# EAGLE schematic FreeRTOS-ESP32-schematic (EAGLE 9.7.0)
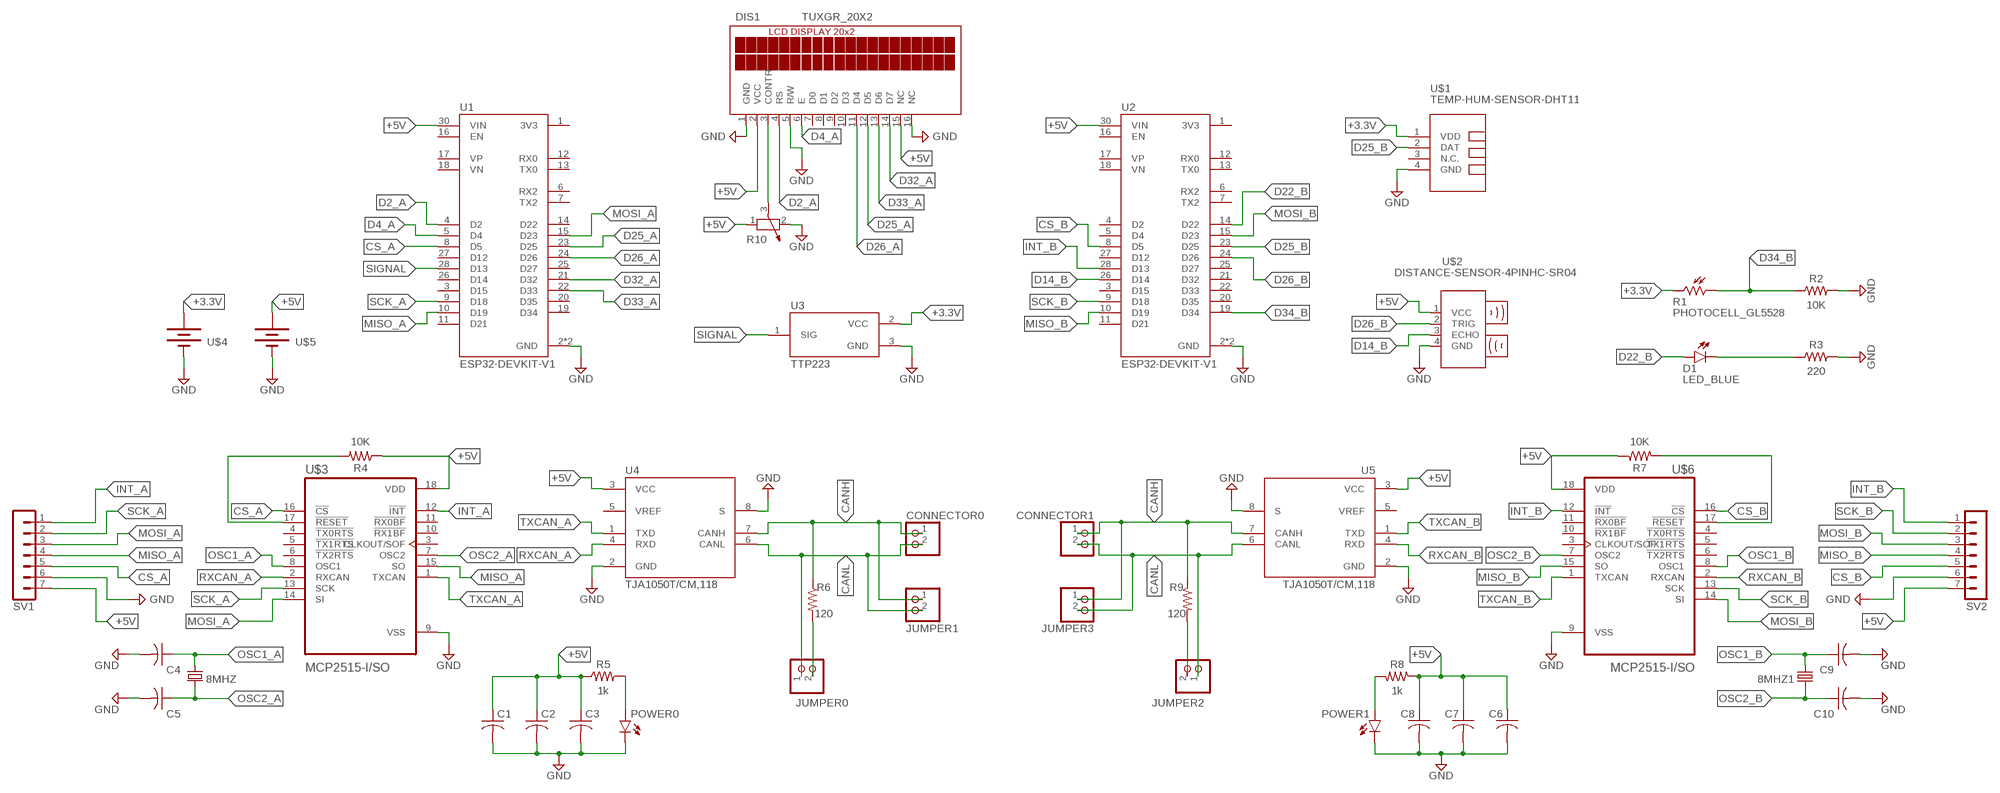
[diagram p0: schematic, sheet 1]

## Parts
8MHZ  CRYSTAL_HC49-11.5L  [XTALRR488W45L1150T500H350B]
8MHZ1  CRYSTAL_HC49-11.5L  [XTALRR488W45L1150T500H350B]
C1  C-USC0805  [C0805]
C2  C-USC0805  [C0805]
C3  C-USC0805  [C0805]
C4  C-USC0805  [C0805]
C5  C-USC0805  [C0805]
C6  C-USC0805  [C0805]
C7  C-USC0805  [C0805]
C8  C-USC0805  [C0805]
C9  C-USC0805  [C0805]
C10  C-USC0805  [C0805]
CONNECTOR0  PINHD-1X2/90  [1X02/90]
CONNECTOR1  PINHD-1X2/90  [1X02/90]
D1  LED_BLUE  LED_CHIPBLUE-3216  [LEDC3216X110N_B]
DIS1  TUXGR_20X2  [TUXGR_20X2]
JUMPER0  PINHD-1X2/90  [1X02/90]
JUMPER1  PINHD-1X2/90  [1X02/90]
JUMPER2  PINHD-1X2/90  [1X02/90]
JUMPER3  PINHD-1X2/90  [1X02/90]
POWER0  LED_BLUE  LED_CHIPBLUE-3216  [LEDC3216X110N_B]
POWER1  LED_BLUE  LED_CHIPBLUE-3216  [LEDC3216X110N_B]
R1  PHOTOCELL_GL5528  [GL5528]
R2  10K  R-US_CHIP-0805(2012-METRIC)  [RESC2012X65]
R3  220  R-US_CHIP-0805(2012-METRIC)  [RESC2012X65]
R4  10K  R-US_CHIP-0805(2012-METRIC)  [RESC2012X65]
R5  1k  R-US_CHIP-0805(2012-METRIC)  [RESC2012X65]
R6  120  R-US_CHIP-0805(2012-METRIC)  [RESC2012X65]
R7  10K  R-US_CHIP-0805(2012-METRIC)  [RESC2012X65]
R8  1k  R-US_CHIP-0805(2012-METRIC)  [RESC2012X65]
R9  120  R-US_CHIP-0805(2012-METRIC)  [RESC2012X65]
R10  POTENTIOMETER_PT-10  [PT-10]
SV1  MA07-1  [MA07-1]
SV2  MA07-1  [MA07-1]
U1  ESP32-DEVKIT-V1  [MODULE_ESP32_DEVKIT_V1]
U2  ESP32-DEVKIT-V1  [MODULE_ESP32_DEVKIT_V1]
U3  TTP223  [MODULE_ZC440600]
U4  TJA1050T/CM,118  [SOIC127P600X175-8N]
U5  TJA1050T/CM,118  [SOIC127P600X175-8N]
U$1  TEMP-HUM-SENSOR-DHT11  [TEMP-HUM-SENSOR-DHT11]
U$2  DISTANCE-SENSOR-4PINHC-SR04  [HC-SR04]
U$3  MCP2515-I/SO  [SOIC127P1030X265-18N]
U$4  BATTERYGENERIC  [BATTERY-GENERIC]
U$5  BATTERYGENERIC  [BATTERY-GENERIC]
U$6  MCP2515-I/SO  [SOIC127P1030X265-18N]

## Nets
+3.3V: R1.2 U3.2(VCC) U$1.1(VDD) U$4.+
+5V: C1.1 C2.1 C3.1 C6.1 C7.1 C8.1 DIS1.2(VCC) DIS1.15(NC) R4.1 R5.1 R7.1 R8.1 R10.1 SV1.7 SV2.7 U1.30(VIN) U2.30(VIN) U4.3(VCC) U5.3(VCC) U$2.1(VCC) U$3.18(VDD) U$5.+ U$6.18(VDD)
CANH: CONNECTOR0.1 CONNECTOR1.1 JUMPER1.1 JUMPER3.1 R6.1 R9.1 U4.7(CANH) U5.7(CANH)
CANL: CONNECTOR0.2 CONNECTOR1.2 JUMPER0.1 JUMPER1.2 JUMPER2.1 JUMPER3.2 U4.6(CANL) U5.6(CANL)
CS_A: SV1.5 U1.8(D5) U$3.16(!CS)
CS_B: SV2.5 U2.8(D5) U$6.16(!CS)
D2_A: DIS1.4(RS) U1.4(D2)
D4_A: DIS1.6(E) U1.5(D4)
D14_B: U2.26(D14) U$2.3(ECHO)
D22_B: D1.2(A) U2.14(D22)
D25_A: DIS1.12(D5) U1.23(D25)
D25_B: U2.23(D25) U$1.2(DAT)
D26_A: DIS1.11(D4) U1.24(D26)
D26_B: U2.24(D26) U$2.2(TRIG)
D32_A: DIS1.14(D7) U1.21(D32)
D33_A: DIS1.13(D6) U1.22(D33)
D34_B: R1.1 R2.1 U2.19(D34)
GND: C1.2 C2.2 C3.2 C4.2 C5.2 DIS1.1(GND) DIS1.5(R/W) DIS1.16(NC) POWER0.1(C) R2.2 R3.2 R10.2 SV1.6 U1.2(GND) U1.29(GND) U2.2(GND) U2.29(GND) U3.3(GND) U4.2(GND) U4.8(S) U$1.4(GND) U$2.4(GND) U$3.9(VSS) U$4.- U$5.-
GND1: C6.2 C7.2 C8.2 C9.2 C10.2 POWER1.1(C) SV2.6 U5.8(S) U$6.9(VSS) ; supply symbol labelled GND
INT_A: SV1.1 U$3.12(!INT)
INT_B: SV2.1 U2.28(D13) U$6.12(!INT)
MISO_A: SV1.4 U1.10(D19) U$3.15(SO)
MISO_B: SV2.4 U2.10(D19) U$6.15(SO)
MOSI_A: SV1.3 U1.15(D23) U$3.14(SI)
MOSI_B: SV2.3 U2.15(D23) U$6.14(SI)
N$1: R4.2 U$3.17(!RESET)
N$2: POWER0.2(A) R5.2
N$3: JUMPER0.2 R6.2
N$4: R7.2 U$6.17(!RESET)
N$5: POWER1.2(A) R8.2
N$6: JUMPER2.2 R9.2
N$7: U5.2(GND) ; supply symbol labelled GND
N$8: D1.1(C) R3.1
N$10: DIS1.3(CONTR) R10.3
OSC1_A: 8MHZ.1 C4.1 U$3.8(OSC1)
OSC1_B: 8MHZ1.1 C9.1 U$6.8(OSC1)
OSC2_A: 8MHZ.2 C5.1 U$3.7(OSC2)
OSC2_B: 8MHZ1.2 C10.1 U$6.7(OSC2)
RXCAN_A: U4.4(RXD) U$3.2(RXCAN)
RXCAN_B: U5.4(RXD) U$6.2(RXCAN)
SCK_A: SV1.2 U1.9(D18) U$3.13(SCK)
SCK_B: SV2.2 U2.9(D18) U$6.13(SCK)
SIGNAL: U1.28(D13) U3.1(SIG)
TXCAN_A: U4.1(TXD) U$3.1(TXCAN)
TXCAN_B: U5.1(TXD) U$6.1(TXCAN)
Unconnected: DIS1.7(D0) DIS1.8(D1) DIS1.9(D2) DIS1.10(D3) U1.1(3V3) U1.3(D15) U1.6(RX2) U1.7(TX2) U1.11(D21) U1.12(RX0) U1.13(TX0) U1.14(D22) U1.16(EN) U1.17(VP) U1.18(VN) U1.19(D34) U1.20(D35) U1.25(D27) U1.26(D14) U1.27(D12) U2.1(3V3) U2.3(D15) U2.4(D2) U2.5(D4) U2.6(RX2) U2.7(TX2) U2.11(D21) U2.12(RX0) U2.13(TX0) U2.16(EN) U2.17(VP) U2.18(VN) U2.20(D35) U2.21(D32) U2.22(D33) U2.25(D27) U2.27(D12) U4.5(VREF) U5.5(VREF) U$1.3(N.C.) U$3.3(CLKOUT/SOF) U$3.4(!TX0RTS) U$3.5(!TX1RTS) U$3.6(!TX2RTS) U$3.10(!RX1BF) U$3.11(!RX0BF) U$6.3(CLKOUT/SOF) U$6.4(!TX0RTS) U$6.5(!TX1RTS) U$6.6(!TX2RTS) U$6.10(!RX1BF) U$6.11(!RX0BF)

## Library data of the parts
8MHZ 8MHZ1 = Frequency-Source:CRYSTAL: Crystal 2Pin - Generic; CATEGORY: Frequency-Source; SERIES: HC49; SUB-CATEGORY: Crystal-2Pin
C1-C10 = rcl:C-US: CAPACITOR, American symbol; SPICEPREFIX: C
CONNECTOR0 CONNECTOR1 JUMPER0 JUMPER1-JUMPER3 = Connector:PINHD-1X2: PIN HEADER; CATEGORY: Headers; DESCRIPTION: Header, Right Angle, 2 Position; MANUFACTURER: Generic; MPN: Generic; OPERATING_TEMPERATURE: Generic; PART_STATUS: Active; PITCH: 0.100" (2.54mm); ROHS_COMPLIANCE: Generic; SERIES: Generic; SUB-CATEGORY: Headers, Male Pins; TYPE: Board to Board or Cable, Unshrouded, Through Hole, Right Angle
D1 POWER0 POWER1 = Opto-Electronic:LED_CHIP: LED - Generic; CATEGORY: Opto-Electronic; COLOR: Blue; SUB-CATEGORY: LED
DIS1 = display-lcd:TUXGR_20X2: Tuxgraphics LCD display 20x2 characters reflective, without background light Source: tuxgr_20x2.pdf; OC_FARNELL: unknown; OC_NEWARK: unknown
R1 = Tinkercad:PHOTOCELL: Photoresistor / Photoconductive cells Reference Datasheet <https://www.sunrom.com/get/753444>
R2-R9 = Resistor:R-US: Resistor Fixed - ANSI; CATEGORY: Resistor; SUB-CATEGORY: Fixed
R10 = rcl:POTENTIOMETER_: Potentiometer; SPICEMODEL: POT; SPICEPREFIX: X
SV1 SV2 = con-lstb:MA07-1: PIN HEADER; OC_FARNELL: unknown; OC_NEWARK: unknown
U1 U2 = ESP32-DEVKIT-V1:ESP32-DEVKIT-V1: Dual core, Wi-Fi: 2.4 GHz up to 150 Mbits/s,BLE (Bluetooth Low Energy) and legacy Bluetooth, 32 bits, Up to 240 MHz Check availability <https://pricing.snapeda.com/parts/ESP32-DEVKIT-V1/Do%20it/view-part?ref=eda>; AVAILABILITY: Not in stock; CHECK_PRICES: https://www.snapeda.com/parts/ESP32-DEVKIT-V1/Do+it/view-part/?ref=eda; DESCRIPTION: Dual core, Wi-Fi: 2.4 GHz up to 150 Mbits/s,BLE (Bluetooth Low Energy) and legacy Bluetooth, 32 bits, Up to 240 MHz; MF: Do it; MP: ESP32-DEVKIT-V1; PACKAGE: None; PRICE: None; SNAPEDA_LINK: https://www.snapeda.com/parts/ESP32-DEVKIT-V1/Do+it/view-part/?ref=snap
U3 = TTP223:TTP223: TTP223 Switch Button Self-Lock Capacitive Touch Sensor Module for Arduino Check availability <https://pricing.snapeda.com/parts/ZC440600/YKS/view-part?ref=eda>; AVAILABILITY: Not in stock; CHECK_PRICES: https://www.snapeda.com/parts/ZC440600/YKS/view-part/?ref=eda; DESCRIPTION: TTP223 Switch Button Self-Lock Capacitive Touch Sensor Module for Arduino; MF: YKS; MP: ZC440600; PACKAGE: None; PRICE: None; SNAPEDA_LINK: https://www.snapeda.com/parts/ZC440600/YKS/view-part/?ref=snap
U4 U5 = TJA1050T_CM_118:TJA1050T/CM,118: 1/1 Transceiver Half CANbus 8-SO; MANUFACTURER: NXP USA; MAXIMUM_PACKAGE_HEIGHT: 1.75 mm; PARTREV: 4; STANDARD: IPC 7351B
U$1 = diy-modules:TEMP-HUM-SENSOR-DHT11: DHT11 - digital humidity & temperature sensor DHT11 datasheet available here: https://akizukidenshi.com/download/ds/aosong/DHT11.pdf Click here to find device on ebay.com <http://www.ebay.com/sch/dht11+digital+sensor>
U$2 = Tinkercad:DISTANCE-SENSOR-4PIN
U$3 U$6 = MCP2515-I_SO:MCP2515-I/SO
U$4 U$5 = Tinkercad:BATTERY